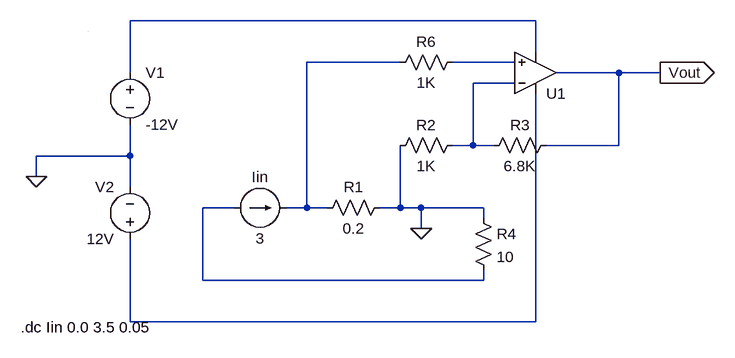
[diagram p0: schematic c-measure-opamp.asc]
c-measure-opamp.asc, the LTspice schematic file:
Version 4
SHEET 1 1000 680
WIRE 688 -16 64 -16
WIRE 688 32 688 -16
WIRE 480 48 336 48
WIRE 656 48 560 48
WIRE 64 64 64 -16
WIRE 816 64 720 64
WIRE 880 64 816 64
WIRE 656 80 592 80
WIRE 592 176 592 80
WIRE 592 176 560 176
WIRE 624 176 592 176
WIRE 816 176 704 176
WIRE 816 176 816 64
WIRE 64 192 64 144
WIRE 64 192 -80 192
WIRE -80 224 -80 192
WIRE 64 240 64 192
WIRE 224 272 176 272
WIRE 336 272 336 48
WIRE 336 272 304 272
WIRE 368 272 336 272
WIRE 480 272 480 176
WIRE 480 272 448 272
WIRE 512 272 480 272
WIRE 608 272 512 272
WIRE 608 288 608 272
WIRE 512 304 512 272
WIRE 176 384 176 272
WIRE 608 384 608 368
WIRE 608 384 176 384
WIRE 64 448 64 320
WIRE 688 448 688 96
WIRE 688 448 64 448
WIRE 0 0 0 0
FLAG -80 224 0
FLAG 880 64 Vout
IOPIN 880 64 Out
FLAG 512 304 0
SYMBOL voltage 64 48 R0
SYMATTR InstName V1
SYMATTR Value -12V
SYMBOL voltage 64 336 R180
WINDOW 0 24 96 Left 2
WINDOW 3 24 16 Left 2
SYMATTR InstName V2
SYMATTR Value 12V
SYMBOL current 224 272 R270
WINDOW 0 32 40 VTop 2
WINDOW 3 -32 40 VBottom 2
WINDOW 123 0 0 Left 2
WINDOW 39 0 0 Left 2
SYMATTR InstName Iin
SYMATTR Value 3
SYMBOL Opamps\\UniversalOpamp2 688 64 M180
SYMATTR InstName U1
SYMBOL res 464 256 R90
WINDOW 0 0 56 VBottom 2
WINDOW 3 32 56 VTop 2
SYMATTR InstName R1
SYMATTR Value 0.2
SYMBOL res 576 160 R90
WINDOW 0 0 56 VBottom 2
WINDOW 3 32 56 VTop 2
SYMATTR InstName R2
SYMATTR Value 1K
SYMBOL res 720 160 R90
WINDOW 0 0 56 VBottom 2
WINDOW 3 32 56 VTop 2
SYMATTR InstName R3
SYMATTR Value 6.8K
SYMBOL res 592 272 R0
SYMATTR InstName R4
SYMATTR Value 10
SYMBOL res 576 32 R90
WINDOW 0 0 56 VBottom 2
WINDOW 3 32 56 VTop 2
SYMATTR InstName R6
SYMATTR Value 1K
TEXT -104 456 Left 2 !.dc Iin 0.0 3.5 0.05

The netlist it stands for:
* c-measure-opamp.asc
V1 N001 0 -12V
V2 N006 0 12V
Iin N005 N002 3
XU1 N003 N004 N006 N001 Vout level.2 Avol=1Meg GBW=10Meg Slew=10Meg ilimit=25m rail=0 Vos=0 phimargin=45 en=0 enk=0 in=0 ink=0 Rin=500Meg  ; pins IN+ IN- V+ V- OUT
R1 0 N002 0.2
R2 N004 0 1K
R3 Vout N004 6.8K
R4 0 N005 10
R6 N003 N002 1K
.dc Iin 0.0 3.5 0.05
.lib UniversalOpamps2.sub
.backanno
.end